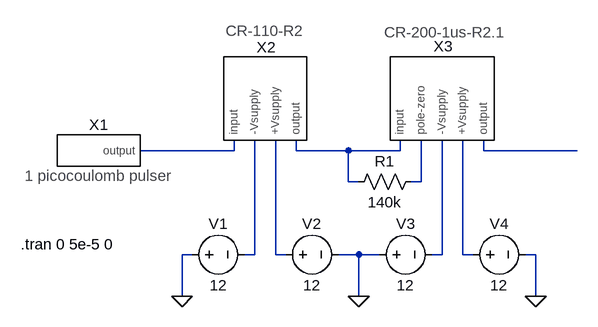
[diagram p0: schematic Setup-With-Pulser-CSP-Shaper.asc]
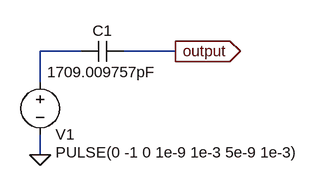
[diagram p1: sub-circuit pulser-0.1picocoulombs.asc]
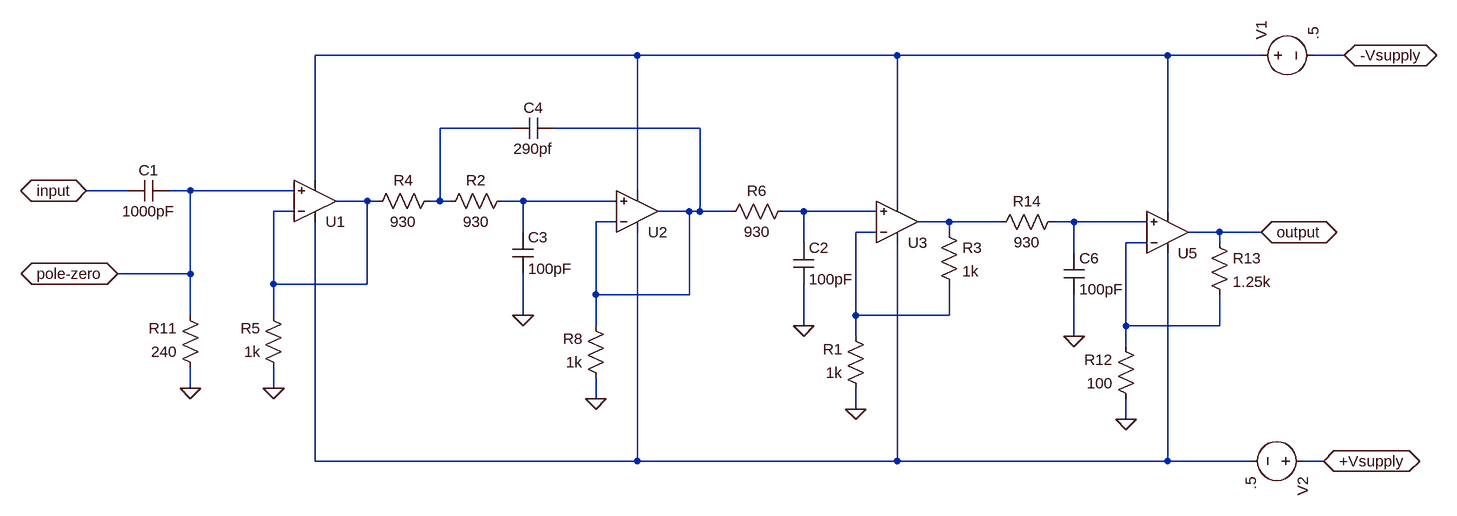
[diagram p2: sub-circuit cr-200-1us-r2.1.asc]
Setup-With-Pulser-CSP-Shaper.asc, the LTspice schematic file:
Version 4
SHEET 1 3236 1496
WIRE -368 -208 -368 -224
WIRE -368 -208 -512 -208
WIRE -272 -208 -272 -224
WIRE -192 -208 -272 -208
WIRE -112 -208 -112 -224
WIRE -112 -208 -192 -208
WIRE 16 -208 16 -224
WIRE 160 -208 16 -208
WIRE -192 -160 -192 -208
WIRE -176 -160 -192 -160
WIRE -80 -160 -80 -224
WIRE -80 -160 -96 -160
WIRE -432 -48 -448 -48
WIRE -336 -48 -336 -224
WIRE -336 -48 -352 -48
WIRE -304 -48 -304 -224
WIRE -288 -48 -304 -48
WIRE -176 -48 -208 -48
WIRE -144 -48 -176 -48
WIRE -48 -48 -48 -224
WIRE -48 -48 -64 -48
WIRE -16 -48 -16 -224
WIRE 0 -48 -16 -48
WIRE 96 -48 80 -48
WIRE -448 16 -448 -48
WIRE -176 16 -176 -48
WIRE 96 16 96 -48
FLAG -176 16 0
FLAG 96 16 0
FLAG -448 16 0
SYMBOL pulser-0.1picocoulombs -576 -208 R0
SYMATTR InstName X1
SYMBOL CR-110-R2 -288 -304 R0
SYMATTR InstName X2
SYMBOL CR-200-1us-R2.1 -48 -304 R0
SYMATTR InstName X3
SYMBOL voltage -304 -48 R270
WINDOW 0 32 56 VTop 2
WINDOW 3 -32 56 VBottom 2
WINDOW 123 0 0 Left 0
WINDOW 39 0 0 Left 0
SYMATTR InstName V2
SYMATTR Value 12
SYMBOL voltage -16 -48 R270
WINDOW 0 32 56 VTop 2
WINDOW 3 -32 56 VBottom 2
WINDOW 123 0 0 Left 0
WINDOW 39 0 0 Left 0
SYMATTR InstName V4
SYMATTR Value 12
SYMBOL voltage -160 -48 R270
WINDOW 0 32 56 VTop 2
WINDOW 3 -32 56 VBottom 2
WINDOW 123 0 0 Left 0
WINDOW 39 0 0 Left 0
SYMATTR InstName V3
SYMATTR Value 12
SYMBOL voltage -448 -48 R270
WINDOW 0 32 56 VTop 2
WINDOW 3 -32 56 VBottom 2
WINDOW 123 0 0 Left 0
WINDOW 39 0 0 Left 0
SYMATTR InstName V1
SYMATTR Value 12
SYMBOL res -80 -176 R90
WINDOW 0 0 56 VBottom 2
WINDOW 3 32 56 VTop 2
SYMATTR InstName R1
SYMATTR Value 140k
TEXT -696 -64 Left 2 !.tran 0 5e-5 0

pulser-0.1picocoulombs.asc, the sub-circuit schematic file:
Version 4
SHEET 1 1164 944
WIRE -624 -64 -688 -64
WIRE -480 -64 -560 -64
WIRE -688 -16 -688 -64
WIRE -688 96 -688 64
FLAG -688 96 0
FLAG -480 -64 output
IOPIN -480 -64 Out
SYMBOL voltage -688 -32 R0
WINDOW 0 24 96 Left 2
WINDOW 3 24 124 Left 2
WINDOW 123 0 0 Left 2
WINDOW 39 24 152 Left 2
SYMATTR InstName V1
SYMATTR Value PULSE(0 -1 0 1e-9 1e-3 5e-9 1e-3)
SYMBOL cap -560 -80 R90
WINDOW 0 0 32 VBottom 2
WINDOW 3 32 32 VTop 2
SYMATTR InstName C1
SYMATTR Value 1709.009757pF

cr-200-1us-r2.1.asc, the sub-circuit schematic file:
Version 4
SHEET 1 6580 1524
WIRE 896 -96 400 -96
WIRE 1296 -96 896 -96
WIRE 1712 -96 1296 -96
WIRE 1856 -96 1712 -96
WIRE 1984 -96 1936 -96
WIRE 704 16 592 16
WIRE 992 16 768 16
WIRE 400 96 400 -96
WIRE 112 112 48 112
WIRE 208 112 176 112
WIRE 368 112 208 112
WIRE 896 112 896 -96
WIRE 480 128 432 128
WIRE 496 128 480 128
WIRE 592 128 592 16
WIRE 592 128 576 128
WIRE 608 128 592 128
WIRE 720 128 688 128
WIRE 864 128 720 128
WIRE 1296 128 1296 -96
WIRE 368 144 336 144
WIRE 976 144 928 144
WIRE 992 144 992 16
WIRE 992 144 976 144
WIRE 1040 144 992 144
WIRE 1152 144 1120 144
WIRE 1264 144 1152 144
WIRE 1712 144 1712 -96
WIRE 864 160 832 160
WIRE 1376 160 1328 160
WIRE 1456 160 1376 160
WIRE 1568 160 1536 160
WIRE 1680 160 1568 160
WIRE 720 176 720 128
WIRE 1264 176 1232 176
WIRE 1376 176 1376 160
WIRE 1792 176 1744 176
WIRE 1856 176 1792 176
WIRE 1152 192 1152 144
WIRE 1680 192 1648 192
WIRE 1792 192 1792 176
WIRE 1568 208 1568 160
WIRE 208 240 208 112
WIRE 208 240 96 240
WIRE 336 256 336 144
WIRE 480 256 480 128
WIRE 480 256 336 256
WIRE 832 272 832 160
WIRE 976 272 976 144
WIRE 976 272 832 272
WIRE 208 304 208 240
WIRE 336 304 336 256
WIRE 720 304 720 240
WIRE 1232 304 1232 176
WIRE 1376 304 1376 256
WIRE 1376 304 1232 304
WIRE 832 320 832 272
WIRE 1152 320 1152 256
WIRE 1648 320 1648 192
WIRE 1792 320 1792 272
WIRE 1792 320 1648 320
WIRE 1232 336 1232 304
WIRE 1568 336 1568 272
WIRE 1648 352 1648 320
WIRE 208 416 208 384
WIRE 336 416 336 384
WIRE 832 432 832 400
WIRE 1232 448 1232 416
WIRE 1648 464 1648 432
WIRE 400 528 400 160
WIRE 896 528 896 176
WIRE 896 528 400 528
WIRE 1296 528 1296 192
WIRE 1296 528 896 528
WIRE 1712 528 1712 208
WIRE 1712 528 1296 528
WIRE 1840 528 1712 528
WIRE 1952 528 1920 528
FLAG 1856 176 output
IOPIN 1856 176 BiDir
FLAG 208 416 0
FLAG 336 416 0
FLAG 832 432 0
FLAG 1232 448 0
FLAG 48 112 input
IOPIN 48 112 BiDir
FLAG 96 240 pole-zero
IOPIN 96 240 BiDir
FLAG 720 304 0
FLAG 1152 320 0
FLAG 1648 464 0
FLAG 1568 336 0
FLAG 1952 528 +Vsupply
IOPIN 1952 528 BiDir
FLAG 1984 -96 -Vsupply
IOPIN 1984 -96 BiDir
SYMBOL res 224 400 R180
WINDOW 0 36 76 Left 2
WINDOW 3 36 40 Left 2
SYMATTR InstName R11
SYMATTR Value 240
SYMBOL res 352 400 R180
WINDOW 0 36 76 Left 2
WINDOW 3 36 40 Left 2
SYMATTR InstName R5
SYMATTR Value 1k
SYMBOL cap 176 96 R90
WINDOW 0 0 32 VBottom 2
WINDOW 3 32 32 VTop 2
SYMATTR InstName C1
SYMATTR Value 1000pF
SYMBOL res 592 112 R90
WINDOW 0 0 56 VBottom 2
WINDOW 3 32 56 VTop 2
SYMATTR InstName R4
SYMATTR Value 930
SYMBOL res 848 416 R180
WINDOW 0 36 76 Left 2
WINDOW 3 36 40 Left 2
SYMATTR InstName R8
SYMATTR Value 1k
SYMBOL Opamps\\UniversalOpamp2 400 128 M180
SYMATTR InstName U1
SYMATTR Value2 Avol=1Meg GBW=80Meg Slew=200Meg
SYMBOL Opamps\\UniversalOpamp2 896 144 M180
SYMATTR InstName U2
SYMATTR Value2 Avol=1Meg GBW=80Meg Slew=200Meg
SYMBOL res 1248 432 R180
WINDOW 0 36 76 Left 2
WINDOW 3 36 40 Left 2
SYMATTR InstName R1
SYMATTR Value 1k
SYMBOL res 1360 160 R0
SYMATTR InstName R3
SYMATTR Value 1k
SYMBOL Opamps\\UniversalOpamp2 1296 160 M180
SYMATTR InstName U3
SYMATTR Value2 Avol=1Meg GBW=80Meg Slew=200Meg
SYMBOL cap 768 0 R90
WINDOW 0 0 32 VBottom 2
WINDOW 3 32 32 VTop 2
SYMATTR InstName C4
SYMATTR Value 290pf
SYMBOL res 704 112 R90
WINDOW 0 0 56 VBottom 2
WINDOW 3 32 56 VTop 2
SYMATTR InstName R2
SYMATTR Value 930
SYMBOL cap 704 176 R0
SYMATTR InstName C3
SYMATTR Value 100pF
SYMBOL cap 1136 192 R0
SYMATTR InstName C2
SYMATTR Value 100pF
SYMBOL res 1136 128 R90
WINDOW 0 0 56 VBottom 2
WINDOW 3 32 56 VTop 2
SYMATTR InstName R6
SYMATTR Value 930
SYMBOL res 1664 448 R180
WINDOW 0 36 76 Left 2
WINDOW 3 36 40 Left 2
SYMATTR InstName R12
SYMATTR Value 100
SYMBOL res 1776 176 R0
SYMATTR InstName R13
SYMATTR Value 1.25k
SYMBOL Opamps\\UniversalOpamp2 1712 176 M180
SYMATTR InstName U5
SYMATTR Value2 Avol=1Meg GBW=80Meg Slew=200Meg
SYMBOL cap 1552 208 R0
SYMATTR InstName C6
SYMATTR Value 100pF
SYMBOL res 1552 144 R90
WINDOW 0 0 56 VBottom 2
WINDOW 3 32 56 VTop 2
SYMATTR InstName R14
SYMATTR Value 930
SYMBOL voltage 1840 -96 R270
WINDOW 123 0 0 Left 0
WINDOW 39 0 0 Left 0
SYMATTR InstName V1
SYMATTR Value .5
SYMBOL voltage 1936 528 R90
WINDOW 123 0 0 Left 0
WINDOW 39 0 0 Left 0
SYMATTR InstName V2
SYMATTR Value .5

The netlist it stands for:
* Setup-With-Pulser-CSP-Shaper.asc
XX1 N001 pulser-0.1picocoulombs
XX2 N001 N002 N005 N006 CR-110-R2  ; pins input output -Vsupply +Vsupply
XX3 N002 N003 N004 N007 N008 cr-200-1us-r2.1
V2 N006 0 12
V4 N008 0 12
V3 0 N007 12
V1 0 N005 12
R1 N004 N002 140k

* block symbol definitions
.subckt pulser-0.1picocoulombs output
V1 N001 0 PULSE(0 -1 0 1e-9 1e-3 5e-9 1e-3)
C1 output N001 1709.009757pF
.ends pulser-0.1picocoulombs

.subckt cr-200-1us-r2.1 input output pole-zero -Vsupply +Vsupply
R11 0 pole-zero 240
R5 0 N004 1k
C1 pole-zero input 1000pF
R4 N002 N004 930
R8 0 N003 1k
XU1 pole-zero N004 N011 N001 N004 level.2 Avol=1Meg GBW=80Meg Slew=200Meg ilimit=25m rail=0 Vos=0 phimargin=45 en=0 enk=0 in=0 ink=0 Rin=500Meg  ; pins IN+ IN- V+ V- OUT
XU2 N005 N003 N011 N001 N003 level.2 Avol=1Meg GBW=80Meg Slew=200Meg ilimit=25m rail=0 Vos=0 phimargin=45 en=0 enk=0 in=0 ink=0 Rin=500Meg  ; pins IN+ IN- V+ V- OUT
R1 0 N009 1k
R3 N007 N009 1k
XU3 N006 N009 N011 N001 N007 level.2 Avol=1Meg GBW=80Meg Slew=200Meg ilimit=25m rail=0 Vos=0 phimargin=45 en=0 enk=0 in=0 ink=0 Rin=500Meg  ; pins IN+ IN- V+ V- OUT
C4 N003 N002 290pf
R2 N005 N002 930
C3 N005 0 100pF
C2 N006 0 100pF
R6 N006 N003 930
R12 0 N010 100
R13 output N010 1.25k
XU5 N008 N010 N011 N001 output level.2 Avol=1Meg GBW=80Meg Slew=200Meg ilimit=25m rail=0 Vos=0 phimargin=45 en=0 enk=0 in=0 ink=0 Rin=500Meg  ; pins IN+ IN- V+ V- OUT
C6 N008 0 100pF
R14 N008 N007 930
V1 N001 -Vsupply .5
V2 +Vsupply N011 .5
.ends cr-200-1us-r2.1

.tran 0 5e-5 0
.lib UniversalOpamps2.sub
.backanno
.end